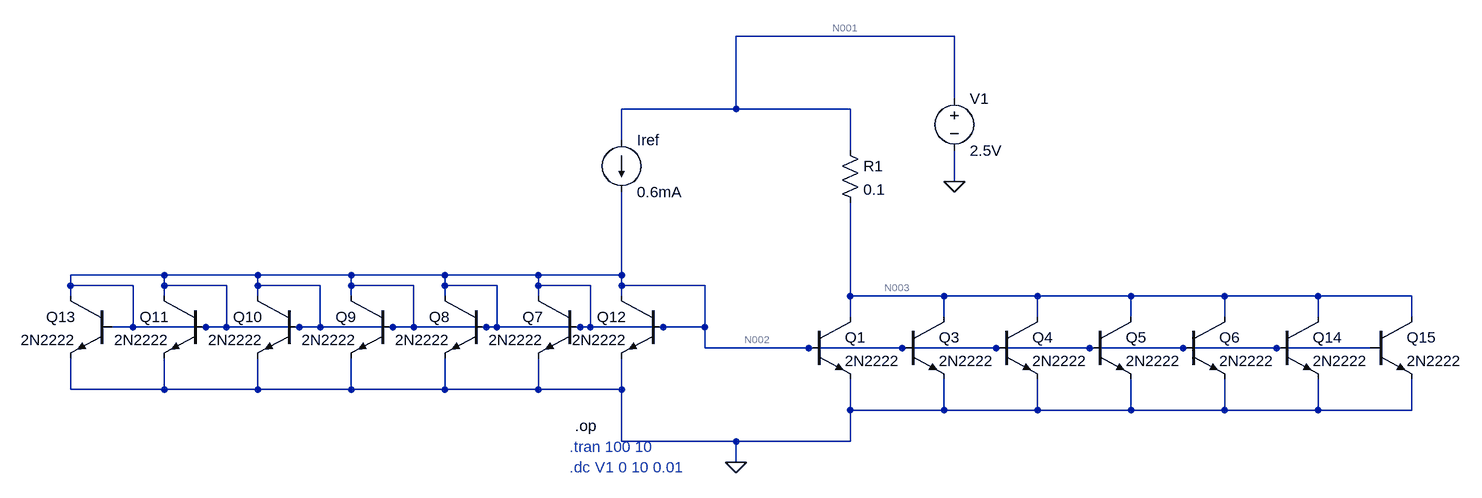
[diagram p0: schematic current_mirror (7cm).asc]
current_mirror (7cm).asc, the LTspice schematic file:
Version 4.1
SHEET 1 1320 680
WIRE 528 -144 192 -144
WIRE 528 -48 528 -144
WIRE 192 -32 192 -144
WIRE 192 -32 16 -32
WIRE 368 -32 192 -32
WIRE 16 16 16 -32
WIRE 368 32 368 -32
WIRE 528 80 528 32
WIRE -688 224 -832 224
WIRE -544 224 -688 224
WIRE -400 224 -544 224
WIRE -256 224 -400 224
WIRE -112 224 -256 224
WIRE 16 224 16 96
WIRE 16 224 -112 224
WIRE -832 240 -832 224
WIRE -736 240 -832 240
WIRE -688 240 -688 224
WIRE -592 240 -688 240
WIRE -544 240 -544 224
WIRE -448 240 -544 240
WIRE -400 240 -400 224
WIRE -304 240 -400 240
WIRE -256 240 -256 224
WIRE -176 240 -256 240
WIRE -112 240 -112 224
WIRE -32 240 -112 240
WIRE 16 240 16 224
WIRE 144 240 16 240
WIRE -832 256 -832 240
WIRE -688 256 -688 240
WIRE -544 256 -544 240
WIRE -400 256 -400 240
WIRE -256 256 -256 240
WIRE -112 256 -112 240
WIRE 16 256 16 240
WIRE 368 256 368 112
WIRE 512 256 368 256
WIRE 656 256 512 256
WIRE 800 256 656 256
WIRE 944 256 800 256
WIRE 1088 256 944 256
WIRE 1232 256 1088 256
WIRE 368 288 368 256
WIRE 512 288 512 256
WIRE 656 288 656 256
WIRE 800 288 800 256
WIRE 944 288 944 256
WIRE 1088 288 1088 256
WIRE 1232 288 1232 256
WIRE -736 304 -736 240
WIRE -736 304 -768 304
WIRE -624 304 -736 304
WIRE -592 304 -592 240
WIRE -592 304 -624 304
WIRE -480 304 -592 304
WIRE -448 304 -448 240
WIRE -448 304 -480 304
WIRE -336 304 -448 304
WIRE -304 304 -304 240
WIRE -304 304 -336 304
WIRE -192 304 -304 304
WIRE -176 304 -176 240
WIRE -176 304 -192 304
WIRE -48 304 -176 304
WIRE -32 304 -32 240
WIRE -32 304 -48 304
WIRE 80 304 -32 304
WIRE 144 304 144 240
WIRE 144 304 80 304
WIRE 144 336 144 304
WIRE 304 336 144 336
WIRE 448 336 304 336
WIRE 592 336 448 336
WIRE 736 336 592 336
WIRE 880 336 736 336
WIRE 1024 336 880 336
WIRE 1168 336 1024 336
WIRE -832 400 -832 352
WIRE -688 400 -688 352
WIRE -688 400 -832 400
WIRE -544 400 -544 352
WIRE -544 400 -688 400
WIRE -400 400 -400 352
WIRE -400 400 -544 400
WIRE -256 400 -256 352
WIRE -256 400 -400 400
WIRE -112 400 -112 352
WIRE -112 400 -256 400
WIRE 16 400 16 352
WIRE 16 400 -112 400
WIRE 368 432 368 384
WIRE 512 432 512 384
WIRE 512 432 368 432
WIRE 656 432 656 384
WIRE 656 432 512 432
WIRE 800 432 800 384
WIRE 800 432 656 432
WIRE 944 432 944 384
WIRE 944 432 800 432
WIRE 1088 432 1088 384
WIRE 1088 432 944 432
WIRE 1232 432 1232 384
WIRE 1232 432 1088 432
WIRE 16 480 16 400
WIRE 192 480 16 480
WIRE 368 480 368 432
WIRE 368 480 192 480
WIRE 192 512 192 480
FLAG 528 80 0
FLAG 192 512 0
SYMBOL npn 304 288 R0
SYMATTR InstName Q1
SYMATTR Value 2N2222
SYMBOL current 16 16 R0
SYMATTR InstName Iref
SYMATTR Value 0.6mA
SYMBOL voltage 528 -64 R0
WINDOW 123 0 0 Left 0
WINDOW 39 0 0 Left 0
SYMATTR InstName V1
SYMATTR Value 2.5V
SYMBOL npn 448 288 R0
SYMATTR InstName Q3
SYMATTR Value 2N2222
SYMBOL npn 592 288 R0
SYMATTR InstName Q4
SYMATTR Value 2N2222
SYMBOL npn 736 288 R0
SYMATTR InstName Q5
SYMATTR Value 2N2222
SYMBOL npn 880 288 R0
SYMATTR InstName Q6
SYMATTR Value 2N2222
SYMBOL npn -48 256 M0
SYMATTR InstName Q7
SYMATTR Value 2N2222
SYMBOL npn -192 256 M0
SYMATTR InstName Q8
SYMATTR Value 2N2222
SYMBOL npn -336 256 M0
SYMATTR InstName Q9
SYMATTR Value 2N2222
SYMBOL npn -480 256 M0
SYMATTR InstName Q10
SYMATTR Value 2N2222
SYMBOL npn -624 256 M0
SYMATTR InstName Q11
SYMATTR Value 2N2222
SYMBOL npn 80 256 M0
SYMATTR InstName Q12
SYMATTR Value 2N2222
SYMBOL npn -768 256 M0
SYMATTR InstName Q13
SYMATTR Value 2N2222
SYMBOL npn 1024 288 R0
SYMATTR InstName Q14
SYMATTR Value 2N2222
SYMBOL npn 1168 288 R0
SYMATTR InstName Q15
SYMATTR Value 2N2222
SYMBOL res 352 16 R0
SYMATTR InstName R1
SYMATTR Value 0.1
TEXT -64 488 Left 2 ;.tran 100 10
TEXT -56 456 Left 2 !.op
TEXT -64 520 Left 2 ;.dc V1 0 10 0.01

The netlist it stands for:
* current_mirror (7cm).asc
Q1 N003 N002 0 0 2N2222
Iref N001 N002 0.6mA
V1 N001 0 2.5V
Q3 N003 N002 0 0 2N2222
Q4 N003 N002 0 0 2N2222
Q5 N003 N002 0 0 2N2222
Q6 N003 N002 0 0 2N2222
Q7 N002 N002 0 0 2N2222
Q8 N002 N002 0 0 2N2222
Q9 N002 N002 0 0 2N2222
Q10 N002 N002 0 0 2N2222
Q11 N002 N002 0 0 2N2222
Q12 N002 N002 0 0 2N2222
Q13 N002 N002 0 0 2N2222
Q14 N003 N002 0 0 2N2222
Q15 N003 N002 0 0 2N2222
R1 N001 N003 0.1
.model NPN NPN
.model PNP PNP
.lib standard.bjt
* .tran 100 10
.op
* .dc V1 0 10 0.01
.backanno
.end

* Results of the author's LTspice run, read from the files saved beside the schematic
* Operating Point:
*   V(n002) = 591.3 mV
*   V(n003) = 2.5 V
*   V(n001) = 2.5 V
*   Ic(Q1) = 86.48 µA
*   Ib(Q1) = 424.4 nA
*   Ie(Q1) = -86.91 µA
*   Is(Q1) = 0 A
*   I(V1) = -1.205 mA
*   Ic(Q5) = 86.48 µA
*   Ib(Q5) = 424.4 nA
*   Ie(Q5) = -86.91 µA
*   Is(Q5) = 0 A
*   Ic(Q7) = 84.87 µA
*   Ib(Q7) = 424.4 nA
*   Ie(Q7) = -85.29 µA
*   Is(Q7) = 0 A
*   Ic(Q10) = 84.87 µA
*   Ib(Q10) = 424.4 nA
*   Ie(Q10) = -85.29 µA
*   Is(Q10) = 0 A
*   Ic(Q12) = 84.87 µA
*   Ib(Q12) = 424.4 nA
*   Ie(Q12) = -85.29 µA
*   Is(Q12) = 0 A
*   Ic(Q13) = 84.87 µA
*   Ib(Q13) = 424.4 nA
*   Ie(Q13) = -85.29 µA
*   Is(Q13) = 0 A
*   Ic(Q4) = 86.48 µA
*   Ib(Q4) = 424.4 nA
*   Ie(Q4) = -86.91 µA
*   Is(Q4) = 0 A
*   Ic(Q15) = 86.48 µA
*   Ib(Q15) = 424.4 nA
*   Ie(Q15) = -86.91 µA
*   Is(Q15) = 0 A
*   I(Iref) = 600 µA
*   Ic(Q8) = 84.87 µA
*   Ib(Q8) = 424.4 nA
*   Ie(Q8) = -85.29 µA
*   Is(Q8) = 0 A
*   Ic(Q9) = 84.87 µA
*   Ib(Q9) = 424.4 nA
*   Ie(Q9) = -85.29 µA
*   Is(Q9) = 0 A
*   Ic(Q11) = 84.87 µA
*   Ib(Q11) = 424.4 nA
*   Ie(Q11) = -85.29 µA
*   Is(Q11) = 0 A
*   Ic(Q14) = 86.48 µA
*   Ib(Q14) = 424.4 nA
*   Ie(Q14) = -86.91 µA
*   Is(Q14) = 0 A
*   Ic(Q3) = 86.48 µA
*   Ib(Q3) = 424.4 nA
*   Ie(Q3) = -86.91 µA
*   Is(Q3) = 0 A
*   Ic(Q6) = 86.48 µA
*   Ib(Q6) = 424.4 nA
*   Ie(Q6) = -86.91 µA
*   Is(Q6) = 0 A
*   I(R1) = 605.4 µA